# EAGLE schematic OpenWest 2015 (EAGLE 7.2.0)
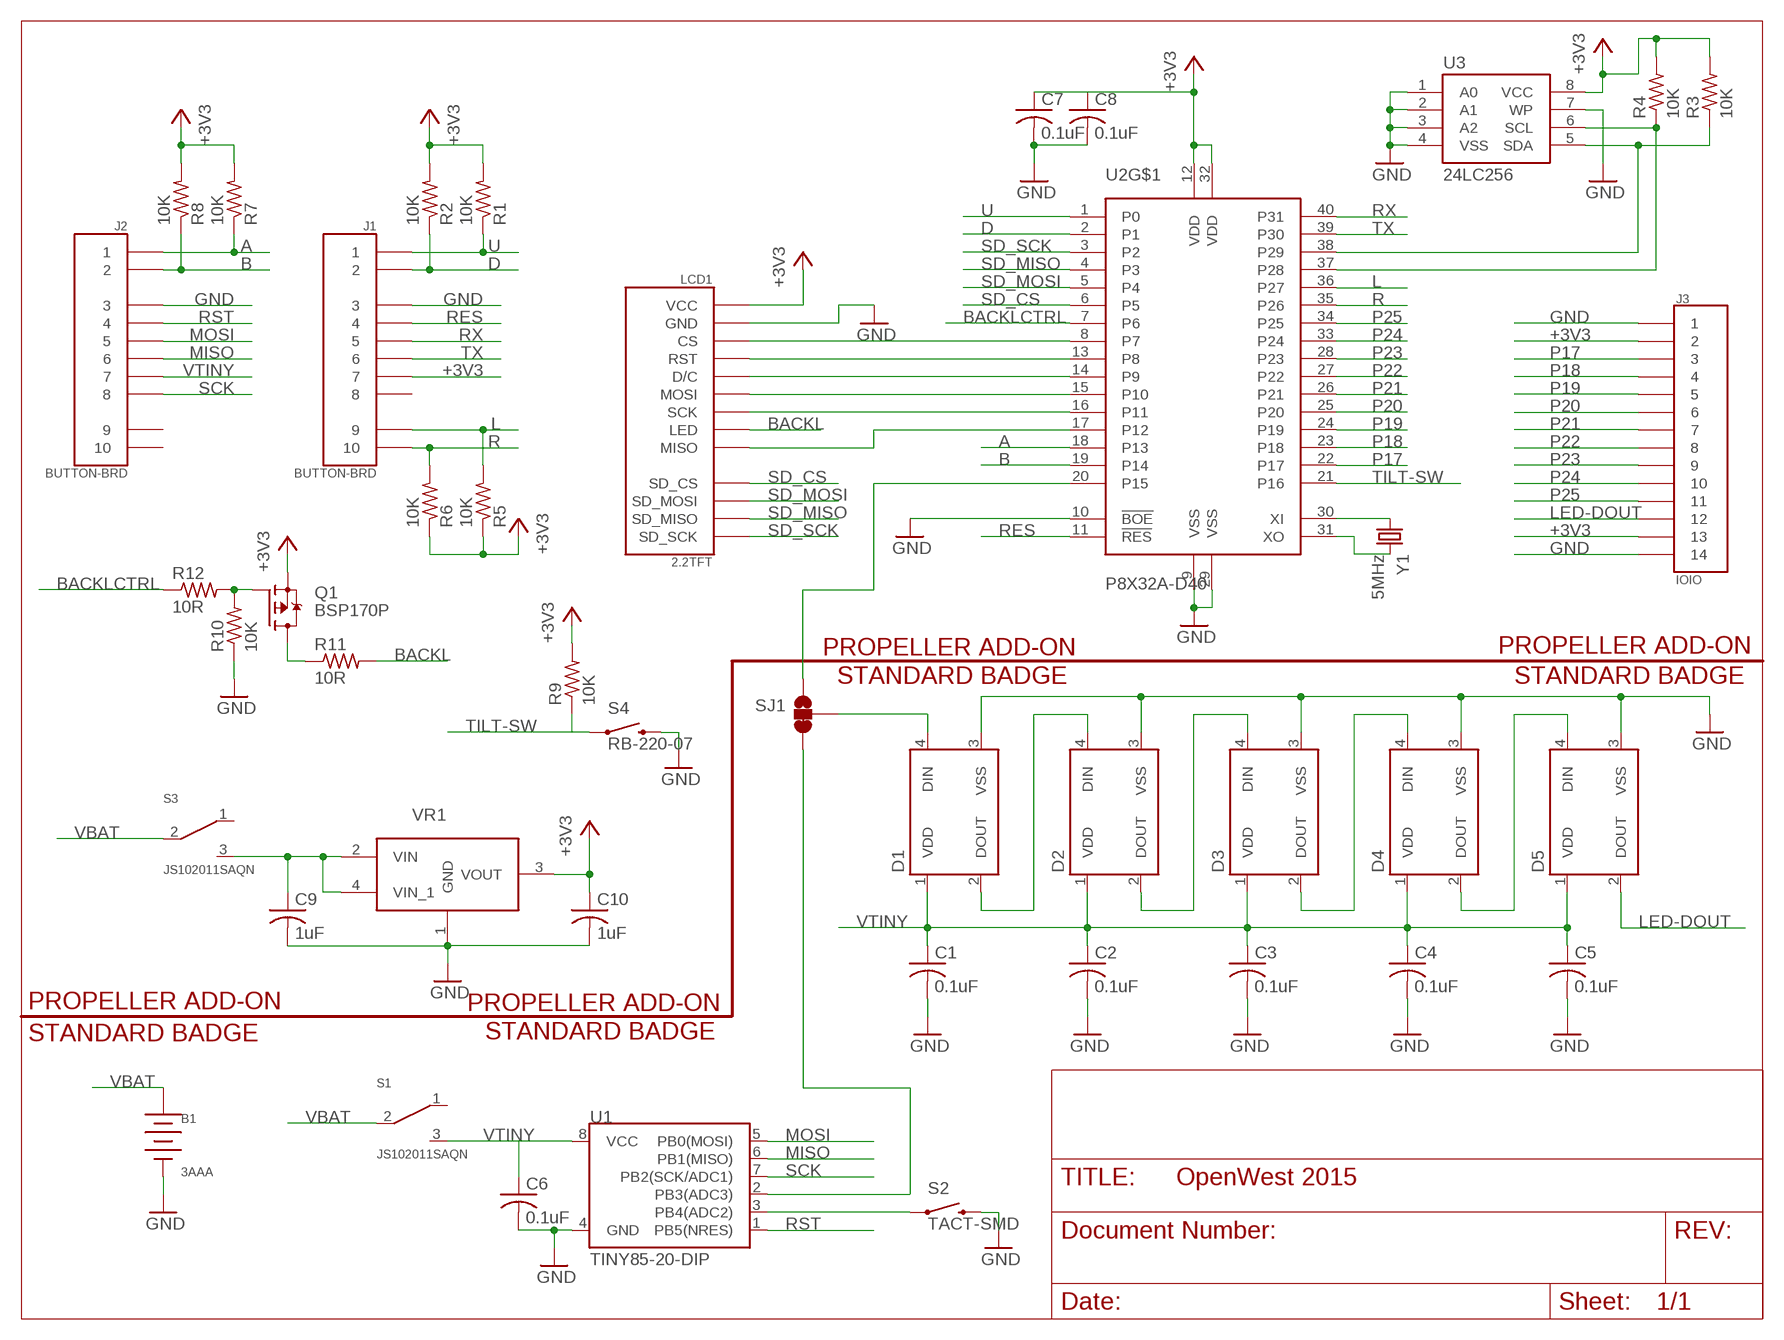
[diagram p0: schematic, sheet 1]

## Parts
B1  3AAA  [FLYING-LEADS]
C1  0.1uF  C-USC1206K  [C1206K]
C2  0.1uF  C-USC1206K  [C1206K]
C3  0.1uF  C-USC1206K  [C1206K]
C4  0.1uF  C-USC1206K  [C1206K]
C5  0.1uF  C-USC1206K  [C1206K]
C6  0.1uF  C-USC1206K  [C1206K]
C7  0.1uF  C-USC1206K  [C1206K]
C8  0.1uF  C-USC1206K  [C1206K]
C9  1uF  C-USC1206K  [C1206K]
C10  1uF  C-USC1206K  [C1206K]
D1  WS2812B  [WS2812B]
D2  WS2812B  [WS2812B]
D3  WS2812B  [WS2812B]
D4  WS2812B  [WS2812B]
D5  WS2812B  [WS2812B]
J1  BUTTON-BRD  [BUTTON-BRD]
J2  BUTTON-BRD  [BUTTON-BRD]
J3  IOIO  [IOIO]
LCD1  2.2TFT  [2.2TFT]
Q1  BSP170P  [SOT223]
R1  10K  R-US_R1206  [R1206]
R2  10K  R-US_R1206  [R1206]
R3  10K  R-US_R1206  [R1206]
R4  10K  R-US_R1206  [R1206]
R5  10K  R-US_R1206  [R1206]
R6  10K  R-US_R1206  [R1206]
R7  10K  R-US_R1206  [R1206]
R8  10K  R-US_R1206  [R1206]
R9  10K  R-US_R1206  [R1206]
R10  10K  R-US_R1206  [R1206]
R11  10R  R-US_R1206  [R1206]
R12  10R  R-US_R1206  [R1206]
S1  JS102011SAQN  [SAQN]
S2  TACT-SMD  [TACT-SMD]
S3  JS102011SAQN  [SAQN]
S4  RB-220-07  [SPST]
SJ1  JUMPER-PAD-3-2OF3_NC_BY_TRACE_LARGE  [PAD-JUMPER-3-2OF3_NC_BY_TRACE_YES_SILK_LARGE]
U1  TINY85-20-DIP  ATTINY45TINY85-20-DIP  [DIP08]
U2  P8X32A-D40  [DIP-40]
U3  24LC256  24LC64  [DIP08]
VR1  MCP17-MCP1700T-3302E/MB  [SOT150P400X160-4N]
Y1  5MHz  CRYSTAL-TH-11.5X5MM  [CRYSTAL-SMD]

## Nets
+3V3: C7.1 C8.1 C10.1 J1.7 J3.P$2 J3.P$13 LCD1.VCC Q1.3(S) R1.2 R2.2 R3.2 R4.2 R5.1 R6.1 R7.2 R8.2 R9.2 U2.12(VDD) U2.32(VDD) U3.8(VCC) VR1.3(VOUT)
A: J2.1 R7.1 U2.18(P13)
B: J2.2 R8.1 U2.19(P14)
BACKL: LCD1.LED R11.2
BACKLCTRL: R12.1 U2.7(P6)
D: J1.2 R2.1 U2.2(P1)
GND: B1.- C1.2 C2.2 C3.2 C4.2 C5.2 C6.2 C7.2 C8.2 C9.2 C10.2 D1.3(VSS) D2.3(VSS) D3.3(VSS) D4.3(VSS) D5.3(VSS) J1.3 J2.3 J3.P$1 J3.P$14 LCD1.GND R10.1 S2.P$3 S4.2 U1.4(GND) U2.9(VSS) U2.10(!BOE) U2.29(VSS) U3.1(A0) U3.2(A1) U3.3(A2) U3.4(VSS) U3.7(WP) VR1.1(GND)
L: J1.9 R5.2 U2.36(P27)
LED-DOUT: D5.2(DOUT) J3.P$12
MISO: J2.6 U1.6(PB1(MISO))
MOSI: J2.5 U1.5(PB0(MOSI))
N$1: D1.4(DIN) SJ1.2
N$2: D1.2(DOUT) D2.4(DIN)
N$3: D2.2(DOUT) D3.4(DIN)
N$4: D3.2(DOUT) D4.4(DIN)
N$5: D4.2(DOUT) D5.4(DIN)
N$6: R4.1 U2.37(P28) U3.6(SCL)
N$7: R3.1 U2.38(P29) U3.5(SDA)
N$8: SJ1.3 U1.2(PB3(ADC3))
N$9: SJ1.1 U2.20(P15)
N$10: LCD1.CS U2.8(P7)
N$11: LCD1.RST U2.13(P8)
N$13: LCD1.D/C U2.14(P9)
N$14: LCD1.MOSI U2.15(P10)
N$15: LCD1.SCK U2.16(P11)
N$16: LCD1.MISO U2.17(P12)
N$21: U2.30(XI) Y1.P$1
N$22: U2.31(XO) Y1.P$2
N$53: C9.1 S3.3 VR1.2(VIN) VR1.4(VIN_1)
N$54: S2.P$1 U1.3(PB4(ADC2))
N$55: Q1.2(D) Q1.4(D) R11.1
N$56: Q1.1(G) R10.2 R12.2
P17: J3.P$3 U2.22(P17)
P18: J3.P$4 U2.23(P18)
P19: J3.P$5 U2.24(P19)
P20: J3.P$6 U2.25(P20)
P21: J3.P$7 U2.26(P21)
P22: J3.P$8 U2.27(P22)
P23: J3.P$9 U2.28(P23)
P24: J3.P$10 U2.33(P24)
P25: J3.P$11 U2.34(P25)
R: J1.10 R6.2 U2.35(P26)
RES: J1.4 U2.11(!RES)
RST: J2.4 U1.1(PB5(NRES))
RX: J1.5 U2.40(P31)
SCK: J2.8 U1.7(PB2(SCK/ADC1))
SD_CS: LCD1.SD_CS U2.6(P5)
SD_MISO: LCD1.SD_MISO U2.4(P3)
SD_MOSI: LCD1.SD_MOSI U2.5(P4)
SD_SCK: LCD1.SD_SCK U2.3(P2)
TILT-SW: R9.1 S4.1 U2.21(P16)
TX: J1.6 U2.39(P30)
U: J1.1 R1.1 U2.1(P0)
VBAT: B1.+ S1.2 S3.2
VTINY: C1.1 C2.1 C3.1 C4.1 C5.1 C6.1 D1.1(VDD) D2.1(VDD) D3.1(VDD) D4.1(VDD) D5.1(VDD) J2.7 S1.3 U1.8(VCC)
Unconnected: J1.8 J2.9 J2.10 S1.1 S3.1

## Notes on the sheet
- PROPELLER ADD-ON | PROPELLER ADD-ON
- STANDARD BADGE | STANDARD BADGE
- PROPELLER ADD-ON | PROPELLER ADD-ON
- STANDARD BADGE | STANDARD BADGE

## Library data of the parts
B1 = BatteryHolders:3AAA
C1-C10 = resistor:C-US: CAPACITOR, American symbol
D1-D5 = SparkFun-LED:WS2812B: WS2812B - Intelligent control LED integrated light source Technical Specifications: Power Supply Voltage (VDD): 3.5 to 5.3 V Input Voltage (VI): -0.5 to VDD+0.5 V Operating Junction Temperature (Topt): -25°C to +80°C Storage Temperature Range (Tstg): -55°C to +150°C
J1 J2 = OpenWestButtonBoard:BUTTON-BRD
J3 = OpenWestButtonBoard:IOIO
LCD1 = 2_2TFTLCD:2.2TFT
Q1 = transistor-fet:BSP170P: SIPMOS(R) Small-Signal-Transistor P-Channel, Enhancement mode Source: http://www.infineon.com/upload/Document/BSP170P_Rev2.4.pdf
R1-R12 = resistor:R-US_: RESISTOR, American symbol
S1 S3 = ck-comp-js-switches:JS102011SAQN: CK-Components JS Series Sub-Miniature Slide Switches SPDT SMD Right Angle
S2 = TactSwitch:TACT-SMD: C&K Components PTS645 Series PTS645SM43SMTR92 LFS http://www.digikey.com/product-detail/en/PTS645SM43SMTR92%20LFS/CKN9112TR-ND/1146840
S4 = TiltSwitch:RB-220-07
SJ1 = SparkFun-Passives:JUMPER-PAD-3-2OF3_NC_BY_TRACE
U1 = SparkFun-DigitalIC:ATTINY45: Atmel 8-pin 2/4/8kB flash uC; PROD_ID: IC-09445
U2 = parallax_propeller:P8X32A-D40: Parallax Propeller P8X32A-D40 40 Pin DIP 32-bit Microprocessor http://www.parallax.com/propeller/
U3 = EEPROM 24LC:24LC64
VR1 = Microchip-MCP170xxxx_MB:MCP17: Low Quiescent Current LDO Regulator; MPN: MCP1700T-3302E/MB; OC_FARNELL: 1439380; OC_NEWARK: 88H9816; PACKAGE: SOT89-3; SUPPLIER: Microchip
Y1 = Crystal-TH-11_5x5:CRYSTAL-TH-11.5X5MM